# EAGLE design Dark_Circle (EAGLE 9.6.2)
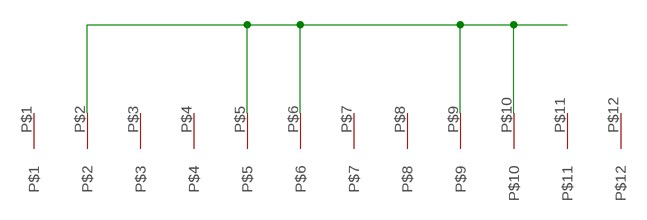
[diagram p0: schematic, sheet 1]

## Parts
U$1  BEAST  [BEAST]

## Nets
N$1: U$1.P$2 U$1.P$5 U$1.P$6 U$1.P$9 U$1.P$10
Unconnected: U$1.P$1 U$1.P$3 U$1.P$4 U$1.P$7 U$1.P$8 U$1.P$11 U$1.P$12

## Library data of the parts
U$1 = beastpins:BEAST

## Board
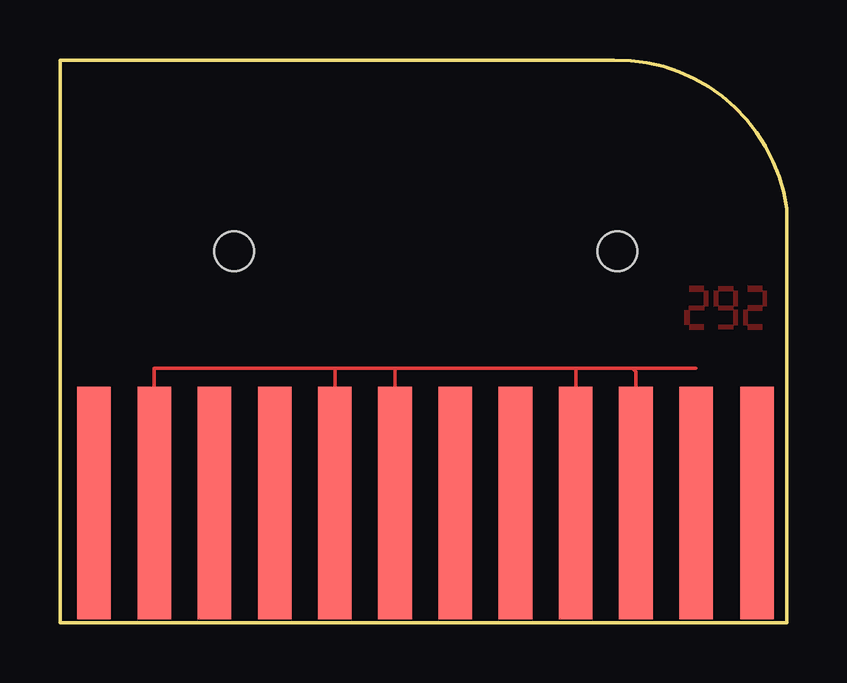
[diagram p1: board, top side]

Size 30.3 x 23.45 mm. Coordinates in mm from the lower left corner, seen from the top.
Outline: 0,0 30.3,0 30.3,17.25 arc83 23.1,23.45 0,23.45 0,0
Copper layers (1*16): Top 0.035mm / dielectric 1.5mm / Bottom 0.035mm
Design rules "default *": minimum track width 6mil, minimum drill 0.35mm, track to track 1mil, track to pad 6mil, pad to pad 6mil, via to via 6mil, smd to smd 6mil, copper to edge 0.002540625mm, drill to drill 1mil, minimum pad ring 10mil, minimum via ring 8mil, stop-mask expansion 4mil, vias tented up to drill 0mil, thermal gap 10mil
Holes 1.65 mm at 7.27,15.49 23.23,15.49

### Footprints (pad centres in the part's own frame; a part is rotated, then mirrored left to right if it is on the bottom)
BEAST = smd 1.4 x 9.7: P$1 -27.61,5.02; P$2 -25.1,5.02; P$3 -22.59,5.02; P$4 -20.08,5.02; P$5 -17.57,5.02; P$6 -15.06,5.02; P$7 -12.55,5.02; P$8 -10.04,5.02; P$9 -7.53,5.02; P$10 -5.02,5.02; P$11 -2.51,5.02; P$12 0.03,5.02

### Placement (x,y rotation side)
U$1  29.03,-0.03 0 top

### Tracks (layer width: path | path; a pad name or v marks a point on that pad's centre or on a via)
N$1
  Top 0.152: 11.51,10.6 3.93,10.6 U$1.P$2 | 11.51,10.6 14.01,10.6 | 14.01,10.6 21.5,10.6 | 21.5,10.6 23.86,10.6 | 23.86,10.6 26.52,10.6 | U$1.P$5 11.46,10.55 11.51,10.6 | U$1.P$6 13.97,10.56 14.01,10.6 | U$1.P$9 21.5,10.6 | U$1.P$10 24.01,10.45 23.86,10.6
N$2
  pour Top: 26.85,13.81 26.85,13.22 27.04,13.22 27.04,13.81
N$3
  pour Top: 26.84,13.02 26.25,13.02 26.25,13.22 26.84,13.22
N$4
  pour Top: 26.25,12.43 26.25,12.23 26.84,12.23 26.84,12.43
N$5
  pour Top: 26.23,12.43 26.05,12.43 26.05,13.02 26.23,13.02
N$6
  pour Top: 28.06,13.81 27.47,13.81 27.47,14.01 28.06,14.01
N$7
  pour Top: 28.07,13.81 28.07,13.22 28.26,13.22 28.26,13.81
N$8
  pour Top: 28.06,13.02 27.47,13.02 27.47,13.22 28.06,13.22
N$9
  pour Top: 28.06,12.23 27.47,12.23 27.47,12.43 28.06,12.43
N$10
  pour Top: 28.07,13.02 28.07,12.43 28.26,12.43 28.26,13.02
N$11
  pour Top: 28.68,14.01 28.68,13.81 29.28,13.81 29.28,14.01
N$12
  pour Top: 28.48,13.02 28.48,12.43 28.67,12.43 28.67,13.02
N$13
  pour Top: 28.68,13.22 28.68,13.02 29.28,13.02 29.28,13.22
N$14
  pour Top: 26.25,14.01 26.25,13.81 26.84,13.81 26.84,14.01
N$15
  pour Top: 29.29,13.81 29.29,13.22 29.47,13.22 29.47,13.81
N$26
  pour Top: 27.27,13.81 27.27,13.22 27.45,13.22 27.45,13.81
N$35
  pour Top: 28.68,12.43 28.68,12.23 29.28,12.23 29.28,12.43